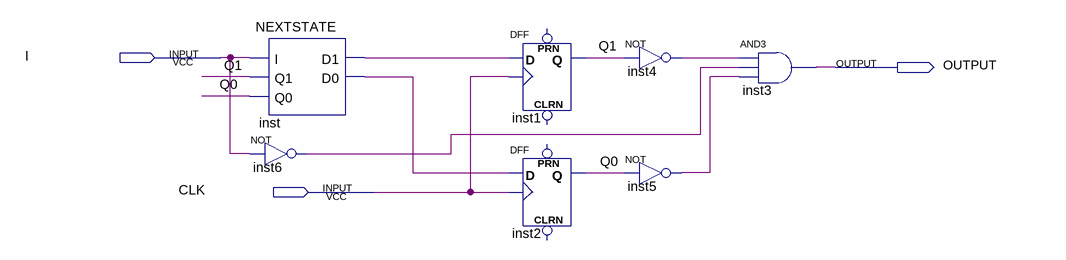
[diagram p0: schematic sheet]
// Quartus schematic MEALY_LBSMSSV.bdf as structural Verilog: 7 symbols, 3 pins
module MEALY_LBSMSSV (
  input  I,
  input  CLK,
  output OUTPUT
);

  wire inst4_out, inst5_out, inst6_out, inst_d0, inst_d1, Q0, Q1;

  NEXTSTATE inst (.I(I), .Q1(Q1), .Q0(Q0), .D1(inst_d1), .D0(inst_d0));
  not inst6 (inst6_out, I);
  DFF inst1 (.CLK(CLK), .D(inst_d1), .Q(Q1));  // open: CLRN, PRN
  DFF inst2 (.CLK(CLK), .D(inst_d0), .Q(Q0));  // open: CLRN, PRN
  not inst4 (inst4_out, Q1);
  not inst5 (inst5_out, Q0);
  and inst3 (OUTPUT, inst4_out, inst6_out, inst5_out);
endmodule
